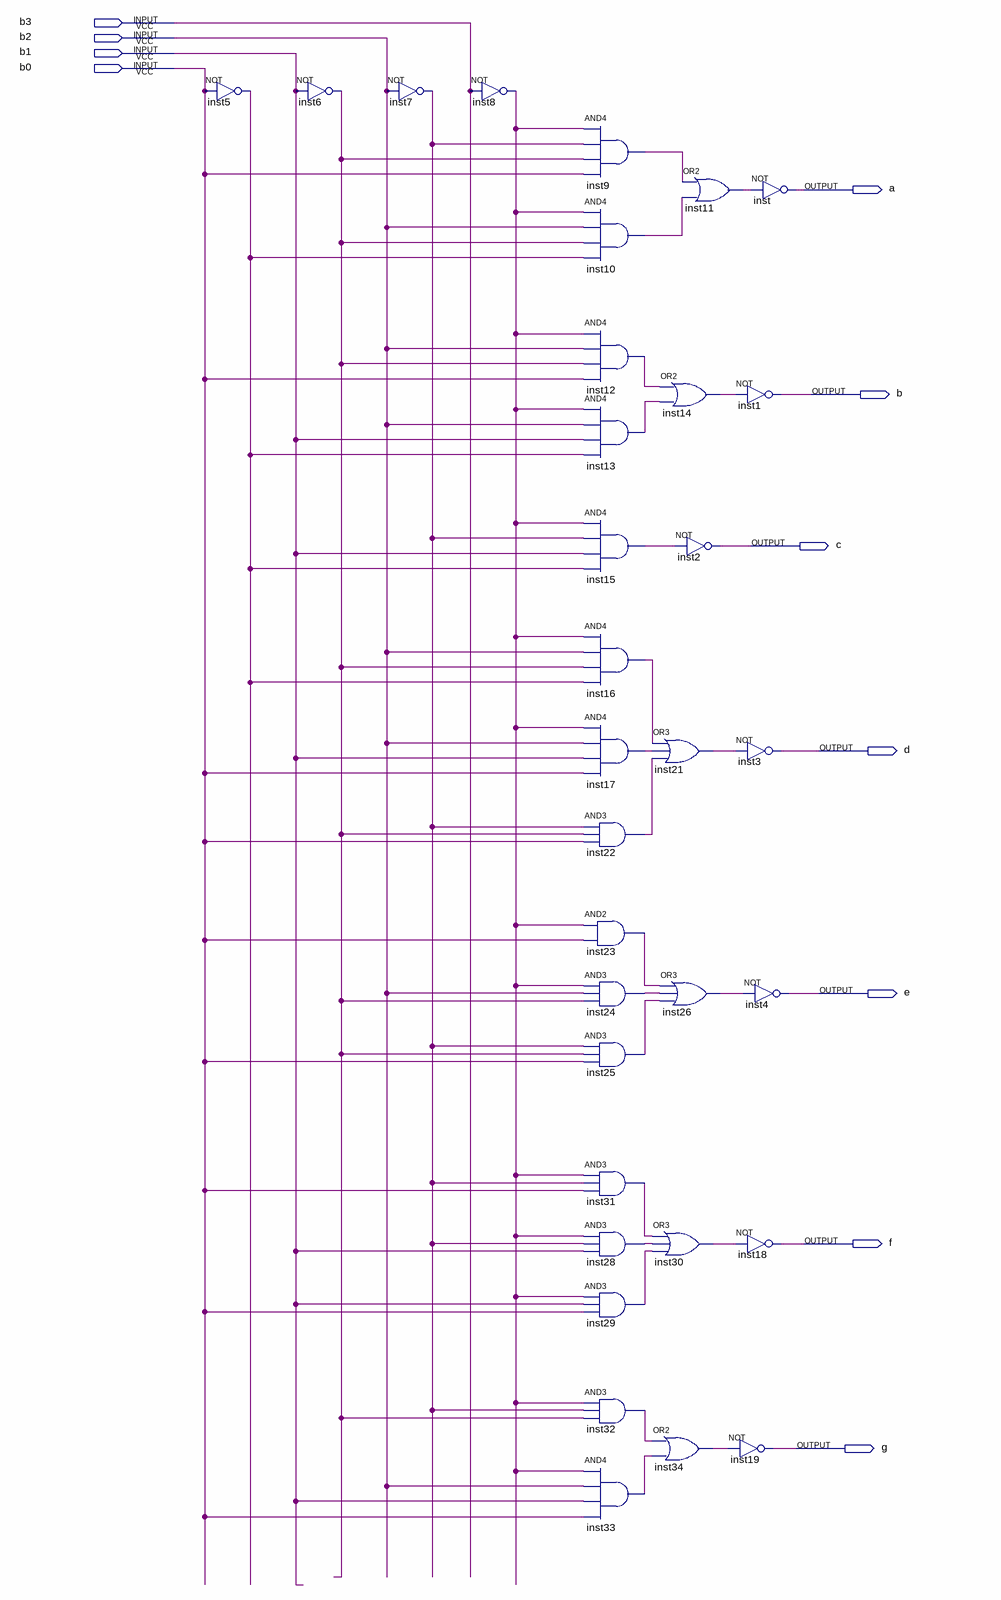
[diagram p0: schematic sheet]
// Quartus schematic b2seg.bdf as structural Verilog: 33 symbols, 11 pins
module b2seg (
  input  b3,
  input  b2,
  input  b1,
  input  b0,
  output a,
  output b,
  output c,
  output d,
  output e,
  output f,
  output g
);

  wire inst5_out, inst6_out, inst7_out, inst8_out, inst9_out, inst10_out, inst11_out, inst12_out, inst13_out,
       inst14_out, inst15_out, inst16_out, inst17_out, inst21_out, inst22_out, inst23_out, inst24_out,
       inst25_out, inst26_out, inst28_out, inst29_out, inst30_out, inst31_out, inst32_out, inst33_out,
       inst34_out;

  not inst5 (inst5_out, b0);
  not inst6 (inst6_out, b1);
  not inst7 (inst7_out, b2);
  not inst8 (inst8_out, b3);
  and inst9 (inst9_out, inst8_out, inst7_out, inst6_out, b0);
  and inst10 (inst10_out, inst8_out, b2, inst6_out, inst5_out);
  and inst12 (inst12_out, inst8_out, b2, inst6_out, b0);
  and inst13 (inst13_out, inst8_out, b2, b1, inst5_out);
  and inst15 (inst15_out, inst8_out, inst7_out, b1, inst5_out);
  and inst16 (inst16_out, inst8_out, b2, inst6_out, inst5_out);
  and inst17 (inst17_out, inst8_out, b2, b1, b0);
  and inst22 (inst22_out, inst7_out, inst6_out, b0);
  and inst23 (inst23_out, inst8_out, b0);
  and inst24 (inst24_out, inst8_out, b2, inst6_out);
  and inst25 (inst25_out, inst7_out, inst6_out, b0);
  and inst31 (inst31_out, inst8_out, inst7_out, b0);
  and inst28 (inst28_out, inst8_out, inst7_out, b1);
  and inst29 (inst29_out, inst8_out, b1, b0);
  and inst32 (inst32_out, inst8_out, inst7_out, inst6_out);
  and inst33 (inst33_out, inst8_out, b2, b1, b0);
  or inst11 (inst11_out, inst9_out, inst10_out);
  or inst14 (inst14_out, inst12_out, inst13_out);
  not inst2 (c, inst15_out);
  or inst21 (inst21_out, inst16_out, inst17_out, inst22_out);
  or inst26 (inst26_out, inst23_out, inst24_out, inst25_out);
  or inst30 (inst30_out, inst31_out, inst28_out, inst29_out);
  or inst34 (inst34_out, inst32_out, inst33_out);
  not inst (a, inst11_out);
  not inst1 (b, inst14_out);
  not inst3 (d, inst21_out);
  not inst4 (e, inst26_out);
  not inst18 (f, inst30_out);
  not inst19 (g, inst34_out);
endmodule
